# EAGLE design Arduino (EAGLE 9.6.2)
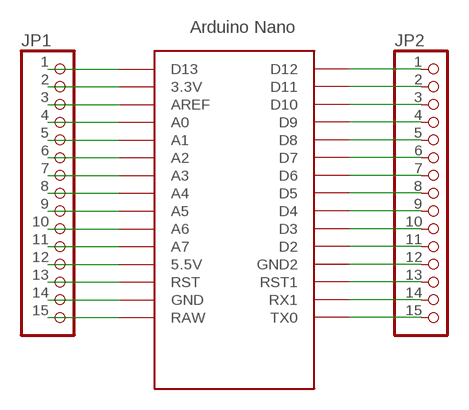
[diagram p0: schematic, sheet 1]

## Parts
JP1  PINHD-1X15  [1X15]
JP2  PINHD-1X15  [1X15]
U$1  NANO  [NANO]

## Nets
N$1: JP1.1 U$1.D13
N$2: JP1.2 U$1.3.3V
N$3: JP1.3 U$1.AREF
N$4: JP1.4 U$1.A0
N$5: JP1.5 U$1.A1
N$6: JP1.6 U$1.A2
N$7: JP1.7 U$1.A3
N$8: JP1.8 U$1.A4
N$9: JP1.9 U$1.A5
N$10: JP1.10 U$1.A6
N$11: JP1.11 U$1.A7
N$12: JP1.12 U$1.5V(5.5V)
N$13: JP1.13 U$1.RST
N$14: JP1.14 U$1.GND
N$15: JP1.15 U$1.RAW
N$16: JP2.1 U$1.D12
N$17: JP2.2 U$1.D11
N$18: JP2.3 U$1.D10
N$19: JP2.4 U$1.D9
N$20: JP2.5 U$1.D8
N$21: JP2.6 U$1.D7
N$22: JP2.7 U$1.D6
N$23: JP2.8 U$1.D5
N$24: JP2.9 U$1.D4
N$25: JP2.10 U$1.D3
N$26: JP2.11 U$1.D2
N$27: JP2.12 U$1.GND1(GND2)
N$28: JP2.13 U$1.RST1
N$29: JP2.14 U$1.RX1
N$30: JP2.15 U$1.TX0
Unconnected: U$1.ICSP1 U$1.ICSP2 U$1.ICSP3 U$1.ICSP4 U$1.ICSP5 U$1.ICSP6

## Library data of the parts
JP1 JP2 = pinhead:PINHD-1X15: PIN HEADER
U$1 = Arduino-clone:NANO: Arduino Nano

## Board
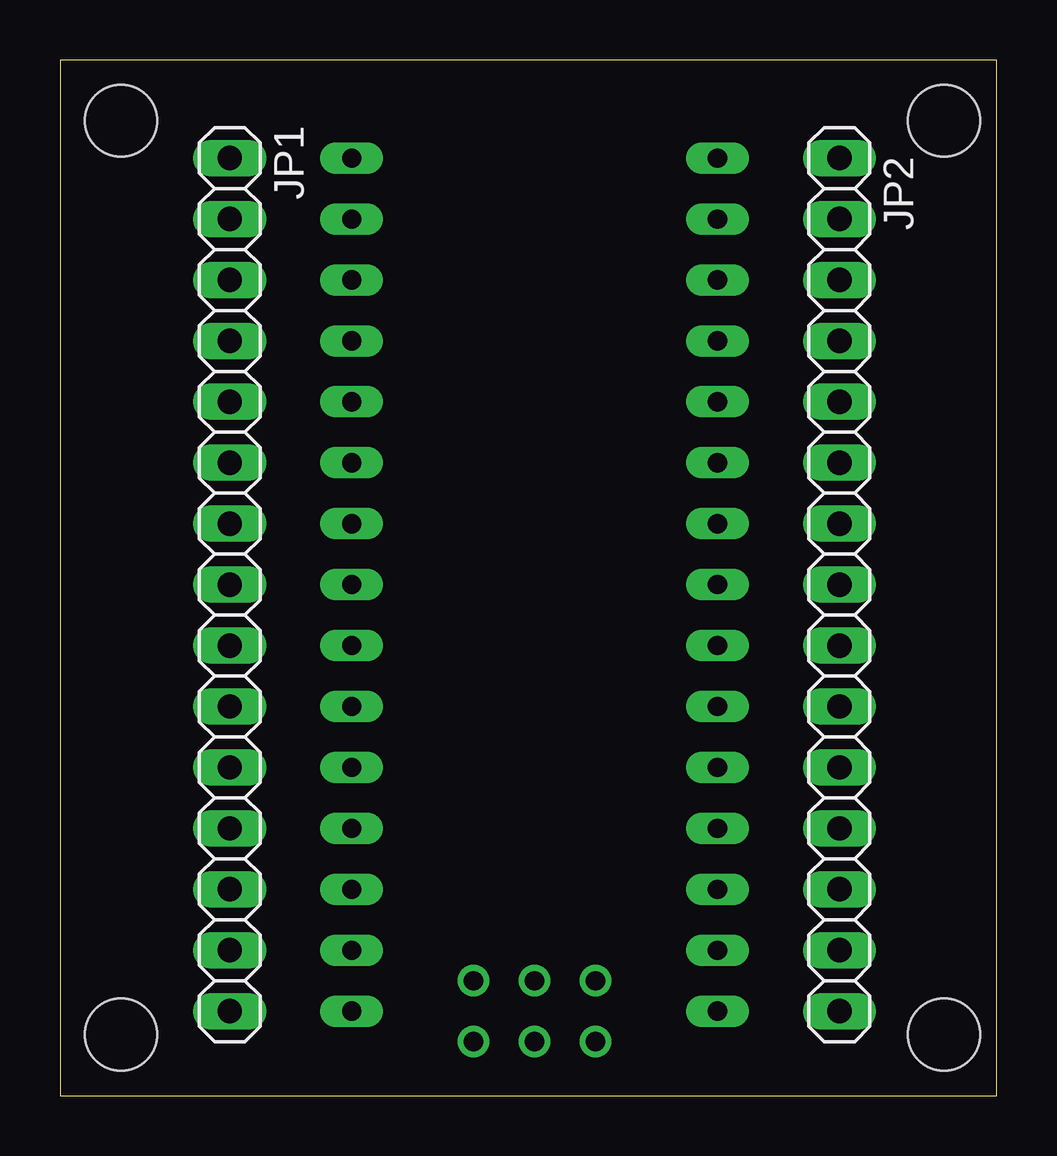
[diagram p1: board, top side]
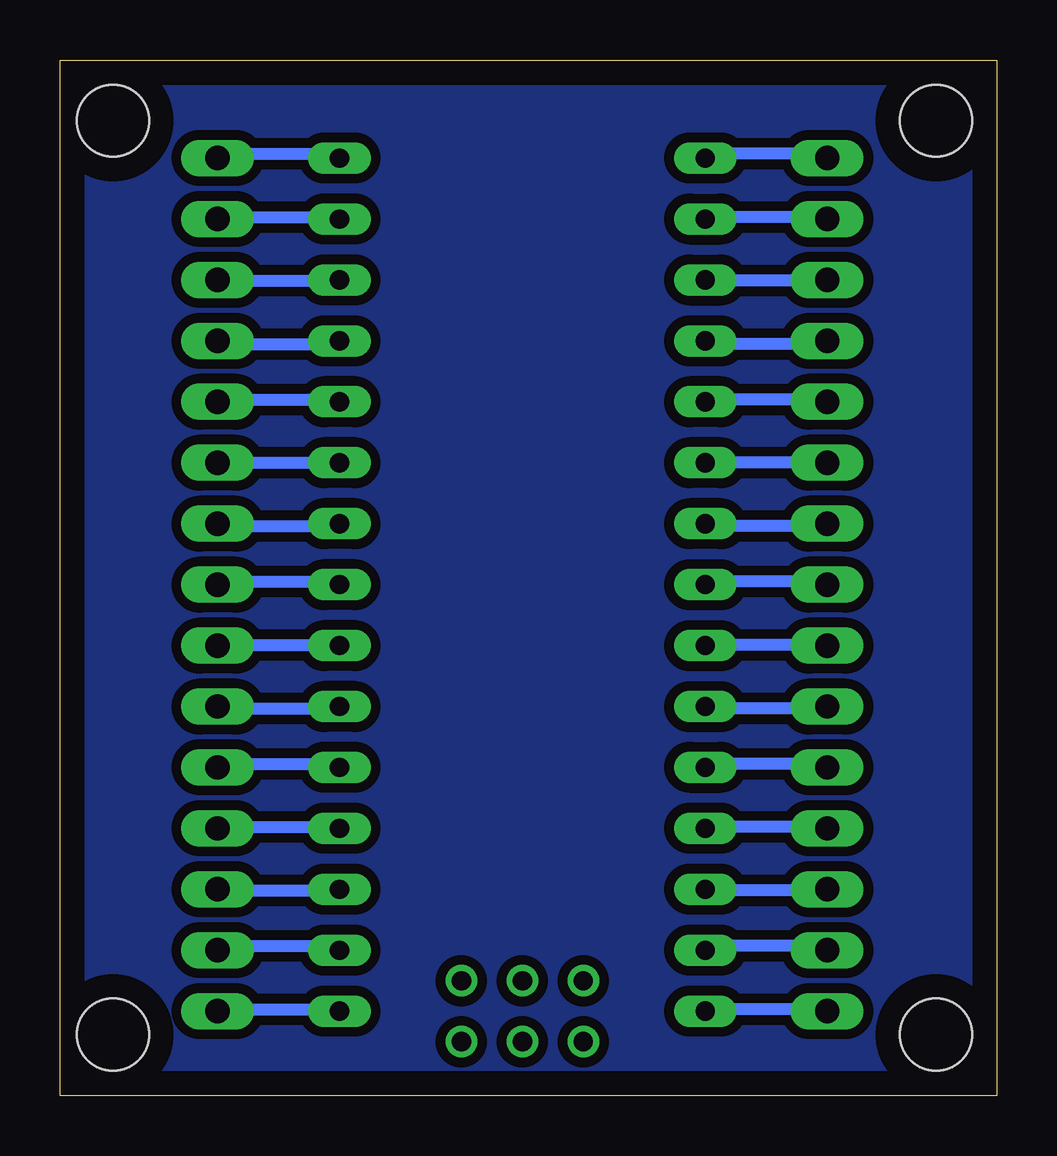
[diagram p2: board, bottom side, seen from below]

Size 39.04 x 43.17 mm. Coordinates in mm from the lower left corner, seen from the top.
Outline: 0,0 39.04,0 39.04,43.17 0,43.17 0,0
Copper layers (1*16): Top 0.035mm / dielectric 1.5mm / Bottom 0.035mm
Design rules "default *": minimum track width 20mil, minimum drill 0.35mm, track to track 6mil, track to pad 6mil, pad to pad 6mil, via to via 6mil, smd to smd 6mil, copper to edge 40mil, drill to drill 6mil, minimum pad ring 10mil, minimum via ring 8mil, stop-mask expansion 4mil, vias tented up to drill 0mil, thermal gap 10mil
Holes 3 mm at 2.54,40.64 2.54,2.54 36.83,40.64 36.83,2.54

### Footprints (pad centres in the part's own frame; a part is rotated, then mirrored left to right if it is on the bottom)
1X15 = drill 1.016 long: 1 -17.78,0; 2 -15.24,0; 3 -12.7,0; 4 -10.16,0; 5 -7.62,0; 6 -5.08,0; 7 -2.54,0; 8 0,0; 9 2.54,0; 10 5.08,0; 11 7.62,0; 12 10.16,0; 13 12.7,0; 14 15.24,0; 15 17.78,0
NANO = drill 0.8 long: 3.3V -10.16,24.13; 5V -10.16,-1.27; A0 -10.16,19.05; A1 -10.16,16.51; A2 -10.16,13.97; A3 -10.16,11.43; A4 -10.16,8.89; A5 -10.16,6.35; A6 -10.16,3.81; A7 -10.16,1.27; AREF -10.16,21.59; D2 5.08,1.27; D3 5.08,3.81; D4 5.08,6.35; D5 5.08,8.89; D6 5.08,11.43; D7 5.08,13.97; D8 5.08,16.51; D9 5.08,19.05; D10 5.08,21.59; D11 5.08,24.13; D12 5.08,26.67; D13 -10.16,26.67; GND -10.16,-6.35; GND1 5.08,-1.27; RAW -10.16,-8.89; RST -10.16,-3.81; RST1 5.08,-3.81; RX1 5.08,-6.35; TX0 5.08,-8.89 | drill 0.8: ICSP1 -5.08,-10.16; ICSP2 -5.08,-7.62; ICSP3 -2.54,-10.16; ICSP4 -2.54,-7.62; ICSP5 0,-10.16; ICSP6 0,-7.62

### Placement (x,y rotation side)
JP1  7.07,21.3 270 top
JP2  32.47,21.3 270 top
U$1  22.31,12.41 0 top

### Tracks (layer width: path | path; a pad name or v marks a point on that pad's centre or on a via)
N$1
  Bottom 0.508: U$1.D13 12.13,39.26 7.3,39.26 JP1.1
N$2
  Bottom 0.508: U$1.3.3V 12.13,36.62 7.3,36.62 JP1.2
N$3
  Bottom 0.508: U$1.AREF 12.13,33.98 7.3,33.98 JP1.3
N$4
  Bottom 0.508: U$1.A0 12.13,31.33 7.3,31.33 JP1.4
N$5
  Bottom 0.508: U$1.A1 12.13,29.02 7.3,29.02 JP1.5
N$6
  Bottom 0.508: JP1.6 U$1.A2
N$7
  Bottom 0.508: U$1.A3 12.13,23.74 7.3,23.74 JP1.7
N$8
  Bottom 0.508: U$1.A4 12.13,21.43 7.3,21.43 JP1.8
N$9
  Bottom 0.508: U$1.A5 12.13,18.79 7.3,18.79 JP1.9
N$10
  Bottom 0.508: U$1.A6 12.13,16.14 7.3,16.14 JP1.10
N$11
  Bottom 0.508: U$1.A7 12.13,13.83 7.3,13.83 JP1.11
N$12
  Bottom 0.508: U$1.5V 12.13,11.19 7.3,11.19 JP1.12
N$13
  Bottom 0.508: U$1.RST 12.13,8.55 7.3,8.55 JP1.13
N$14
  Bottom 0.508: U$1.GND 12.13,6.24 7.3,6.24 JP1.14
N$15
  Bottom 0.508: U$1.RAW 12.13,3.6 7.3,3.6 JP1.15
N$16
  Bottom 0.508: U$1.D12 27.65,39.26 32.47,39.26 JP2.1
N$17
  Bottom 0.508: U$1.D11 27.65,36.62 32.47,36.62 JP2.2
N$18
  Bottom 0.508: U$1.D10 27.65,33.98 32.47,33.98 JP2.3
N$19
  Bottom 0.508: U$1.D9 27.65,31.33 32.47,31.33 JP2.4
N$20
  Bottom 0.508: U$1.D8 27.65,29.02 32.47,29.02 JP2.5
N$21
  Bottom 0.508: JP2.6 U$1.D7
N$22
  Bottom 0.508: U$1.D6 27.65,23.74 32.47,23.74 JP2.7
N$23
  Bottom 0.508: U$1.D5 27.65,21.43 32.47,21.43 JP2.8
N$24
  Bottom 0.508: U$1.D4 27.65,18.79 32.47,18.79 JP2.9
N$25
  Bottom 0.508: U$1.D3 27.65,16.14 32.47,16.14 JP2.10
N$26
  Bottom 0.508: U$1.D2 27.65,13.83 32.47,13.83 JP2.11
N$27
  Bottom 0.508: U$1.GND1 27.65,11.19 32.47,11.19 JP2.12
N$28
  Bottom 0.508: U$1.RST1 27.65,8.55 32.47,8.55 JP2.13
N$29
  Bottom 0.508: U$1.RX1 27.65,6.24 32.47,6.24 JP2.14
N$30
  Bottom 0.508: U$1.TX0 27.65,3.6 32.47,3.6 JP2.15
N$31
  pour Bottom (isolate 0.406): 39.04,0 0,0 0,43.17 39.04,43.17